# Altium schematic sheet voice_launch.SchDoc
size A3
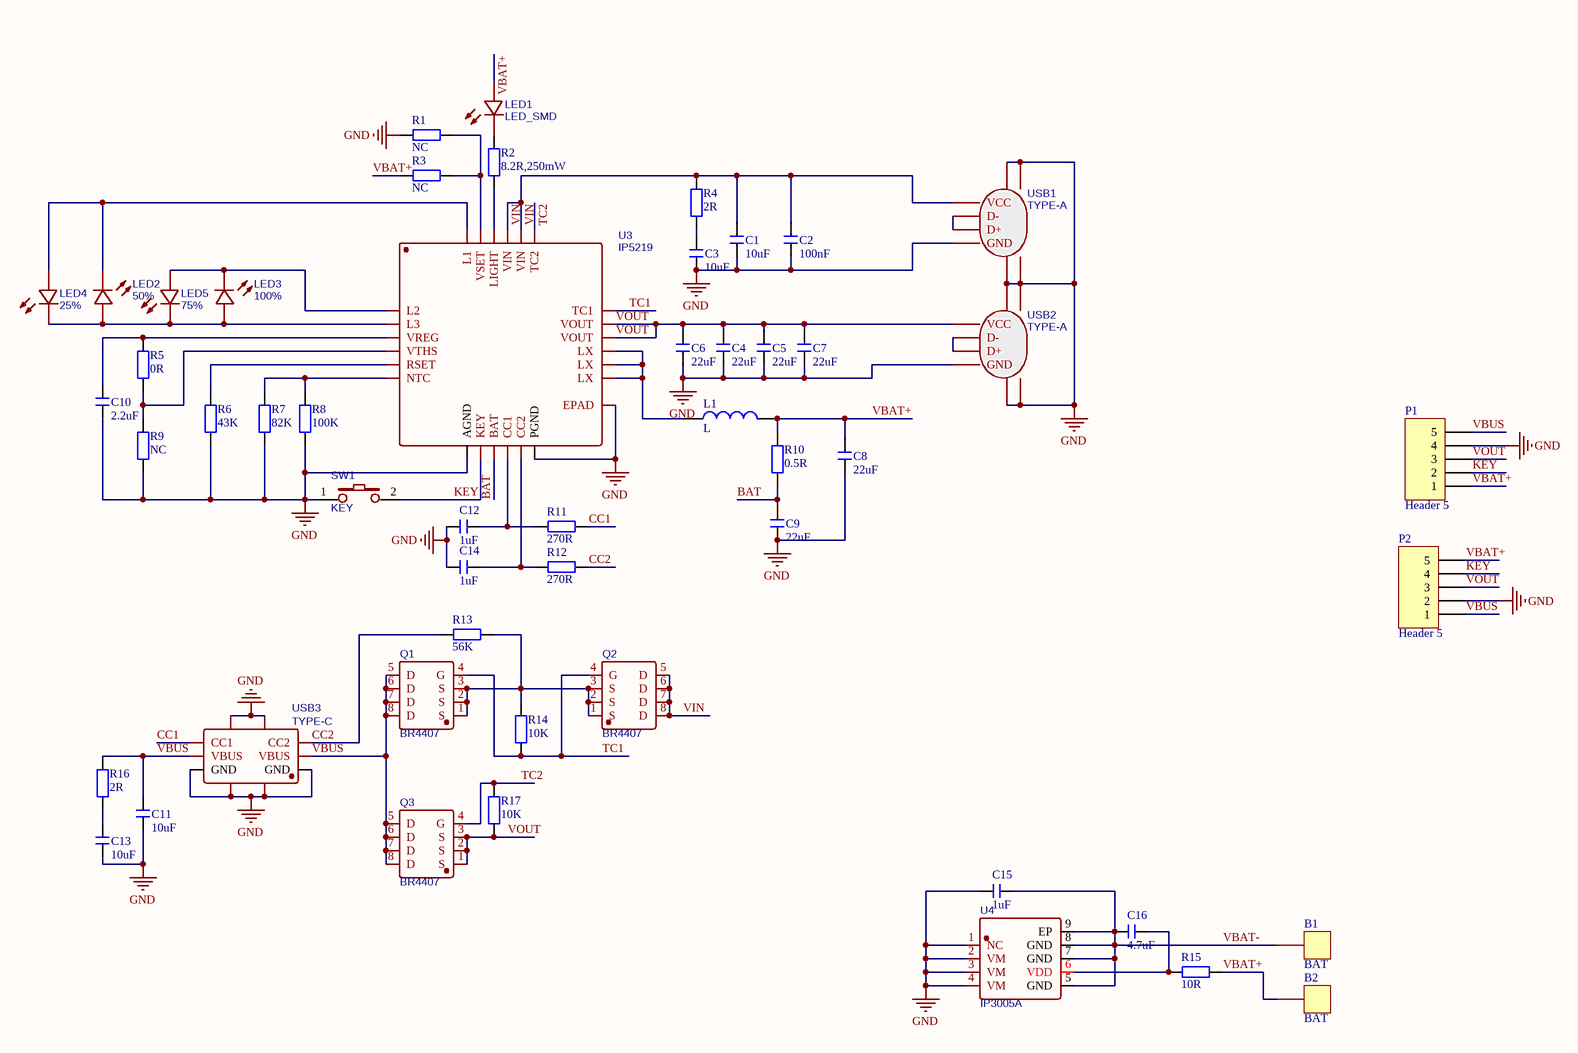
[diagram p0: voice_launch.SchDoc]

## Parts
B1  BAT  [BAT]
B2  BAT  [BAT]
C1  10uF  [C0603]
C2  100nF  [C0603]
C3  10uF  [C0603]
C4  22uF  [C0603]
C5  22uF  [C0603]
C6  22uF  [C0603]
C7  22uF  [C0603]
C8  22uF  [C0603]
C9  22uF  [C0603]
C10  2.2uF  [C0603]
C11  10uF  [C0603]
C12  1uF  [C0603]
C13  10uF  [C0603]
C14  1uF  [C0603]
C15  1uF  [C0805]
C16  4.7uF  [C0805]
L1  L  [IND-SMD]
LED1  LED_SMD  [LED-SMD]
LED2  50%  [LED0603]
LED3  100%  [LED0603]
LED4  25%  [LED0603]
LED5  75%  [LED0603]
P1  Header 5  [CONN-TH_S5B-PH-K-S-LF-SN]
P2  Header 5  [CONN-TH_B6B-PH-K-S]
Q1  BR4407  [PMOS-SOP-8]
Q2  BR4407  [PMOS-SOP-8]
Q3  BR4407  [PMOS-SOP-8]
R1  NC  [R0603]
R2  8.2R,250mW  [R0603]
R3  NC  [R0603]
R4  2R  [R0603]
R5  0R  [R0603]
R6  43K  [R0603]
R7  82K  [R0603]
R8  100K  [R0603]
R9  NC  [R0603]
R10  0.5R  [R0603]
R11  270R  [R0603]
R12  270R  [R0603]
R13  56K  [R0603]
R14  10K  [R0603]
R15  10R  [R0805]
R16  2R  [R0603]
R17  10K  [R0603]
SW1  KEY  [SW-SMD_TS24CA]
U3  IP5219  [QFN-24]
U4  IP3005A  [IP3005A]
USB1  TYPE-A  [USB-A]
USB2  TYPE-A  [USB-A]
USB3  TYPE-C  [TYPE-C]

## Nets
GND: C1.1 C2.1 C3.1 C4.1 C5.1 C6.1 C7.1 C8.1 C9.1 C10.1 C11.1 C12.2 C13.1 C14.2 C15.2 P1.4 P2.2 R1.2 R6.1 R7.1 R8.1 R9.1 SW1.1 U3.7(AGND) U3.12(PGND) U3.25(EPAD) U4.1(NC) U4.2(VM) U4.3(VM) U4.4(VM) USB1.4(GND) USB1.5 USB1.6 USB1.7 USB1.8 USB2.4(GND) USB2.5 USB2.6 USB2.7 USB2.8 USB3.7 USB3.8 USB3.9 USB3.10 USB3.A12(GND) USB3.B12(GND)
BAT: C9.2 R10.1 U3.9(BAT)
CC1: R11.1 USB3.A5(CC1)
CC2: R12.1 R13.2 USB3.B5(CC2)
KEY: P1.2 P2.4 SW1.2 U3.8(KEY)
TC1: Q1.4(G) Q2.4(G) R14.1 U3.18(TC1)
TC2: Q3.4(G) R17.2 U3.19(TC2)
VBAT+: B2.1 C8.2 L1.2 LED1.1(+) P1.1 P2.5 R3.2 R10.2 R15.1
VBAT-: B1.1 C15.1 C16.2 U4.5(GND) U4.7(GND) U4.8(GND) U4.9(EP)
VBUS: C11.2 P1.5 P2.1 Q1.5(D) Q1.6(D) Q1.7(D) Q1.8(D) Q3.5(D) Q3.6(D) Q3.7(D) Q3.8(D) R16.1 USB3.A9(VBUS) USB3.B9(VBUS)
VIN: C1.2 C2.2 Q2.5(D) Q2.6(D) Q2.7(D) Q2.8(D) R4.2 U3.20(VIN) U3.21(VIN) USB1.1(VCC)
VOUT: C4.2 C5.2 C6.2 C7.2 P1.3 P2.3 Q3.1(S) Q3.2(S) Q3.3(S) R17.1 U3.16(VOUT) U3.17(VOUT) USB2.1(VCC)
NetC3_2: C3.2 R4.1
NetC10_2: C10.2 R5.2 U3.3(VREG)
NetC12_1: C12.1 R11.2 U3.10(CC1)
NetC13_2: C13.2 R16.2
NetC14_1: C14.1 R12.2 U3.11(CC2)
NetC16_1: C16.1 R15.2 U4.6(VDD)
NetL1_1: L1.1 U3.13(LX) U3.14(LX) U3.15(LX)
NetLED1_2: LED1.2(-) R2.2
NetLED2_1: LED2.1(+) LED3.1(+) LED4.2(-) LED5.2(-) U3.2(L3)
NetLED2_2: LED2.2(-) LED4.1(+) U3.24(L1)
NetLED3_2: LED3.2(-) LED5.1(+) U3.1(L2)
NetQ1_1: Q1.1(S) Q1.2(S) Q1.3(S) Q2.1(S) Q2.2(S) Q2.3(S) R13.1 R14.2
NetR1_1: R1.1 R3.1 U3.23(VSET)
NetR2_1: R2.1 U3.22(LIGHT)
NetR5_1: R5.1 R9.2 U3.4(VTHS)
NetR6_2: R6.2 U3.5(RSET)
NetR7_2: R7.2 R8.2 U3.6(NTC)
NetUSB1_2: USB1.2(D-) USB1.3(D+)
NetUSB2_2: USB2.2(D-) USB2.3(D+)

## Library data of the parts
C1-C16 = Cap: 无极性贴片电容; 版权归属: 源创客; BOM名称: 无极性贴片电容; 学习资源: www.ooocke.com
L1 = L: 小功率贴片电感; 版权归属: 源创客; BOM名称: 小功率贴片电感; 学习资源: www.ooocke.com
LED1 = LED_SMD: BOM_Manufacturer: Foshan NationStar Optoelectronics; BOM_Manufacturer Part: FC-1608GHK-570A08; Contributor: LCSC; BOM_Supplier: LCSC; BOM_Supplier Part: C193901; BOM_JLCPCB Part Class: Extended Part; spicePre: L; spiceSymbolName: FC-1608GHK-570A08
LED2-LED5 = LED: LED0603; BOM_Manufacturer: Foshan NationStar Optoelectronics; BOM_Manufacturer Part: FC-1608GHK-570A08; Contributor: LCSC; BOM_Supplier: LCSC; BOM_Supplier Part: C193901; BOM_JLCPCB Part Class: Extended Part; spicePre: L; spiceSymbolName: FC-1608GHK-570A08
P1 P2 = Header 5: Header, 5-Pin; LatestRevisionDate: 17-Jul-2002; LatestRevisionNote: Re-released for DXP Platform.; Publisher: Altium Limited
Q1-Q3 = BR4407: C328572; BOM_Manufacturer: BLUE ROCKET; Contributor: LCSC; BOM_Supplier: LCSC; BOM_Supplier Part: C328572; BOM_Manufacturer Part: BR4407; BOM_JLCPCB Part Class: Extended Part; spicePre: Q; spiceSymbolName: BR4407
R1-R17 = RES: 贴片电阻; 版权归属: 源创客; BOM名称: 贴片电阻; 学习资源: www.ooocke.com
SW1 = KEY: BOM_Manufacturer: Korean Hroparts Elec; BOM_Manufacturer Part: K2-6639SP-V4SC-04; Contributor: LCSC; BOM_Supplier: LCSC; BOM_Supplier Part: C223741; BOM_JLCPCB Part Class: Extended Part; spicePre: S; spiceSymbolName: K2-6639SP-V4SC-04
U3 = IP5219: 充放电升压模块; BOM_Manufacturer: INJOINIC; Contributor: LCSC; BOM_Supplier: LCSC; BOM_Supplier Part: C181694; BOM_Manufacturer Part: IP5219; BOM_JLCPCB Part Class: Extended Part; spicePre: U; spiceSymbolName: IP5219
U4 = IP3005A: BOM_Manufacturer: INJOINIC; Contributor: LCSC; BOM_Supplier: LCSC; BOM_Manufacturer Part: IP3005A; BOM_Supplier Part: C181685; BOM_JLCPCB Part Class: Extended Part; spicePre: U; spiceSymbolName: IP3005A
USB1 USB2 = TYPE-A: BOM_Manufacturer: ValuePro; BOM_Manufacturer Part: A/FPaste board Dparagraph10Four feet without curling ironLCPVinyl6.8Reverse; BOM_Supplier: LCSC; BOM_Supplier Part: C42474; BOM_JLCPCB Part Class: Extended Part; spicePre: U; spiceSymbolName: A/FPaste board Dparagraph10Four feet without curling ironLCPVinyl6.8Reverse
USB3 = TYPE-C: TYPE-C / |C2764612; BOM_Manufacturer: XKB Connectivity(中国星坤); BOM_Manufacturer Part: U262-061N-4BVC11; Contributor: LCSC; BOM_Supplier: LCSC; BOM_Supplier Part: C2764612; spicePre: U; spiceSymbolName: U262-061N-4BVC11